# EasyEDA schematic SCH_WGE_Slimevr rev 2.2_2023-11-07.json
TITLE: ThingVR Pico tracker; REV: 2.1; Date: 2023-09-04; Sheet: 1/1; Drawn By: JuliLeThing; Company: ThingVR
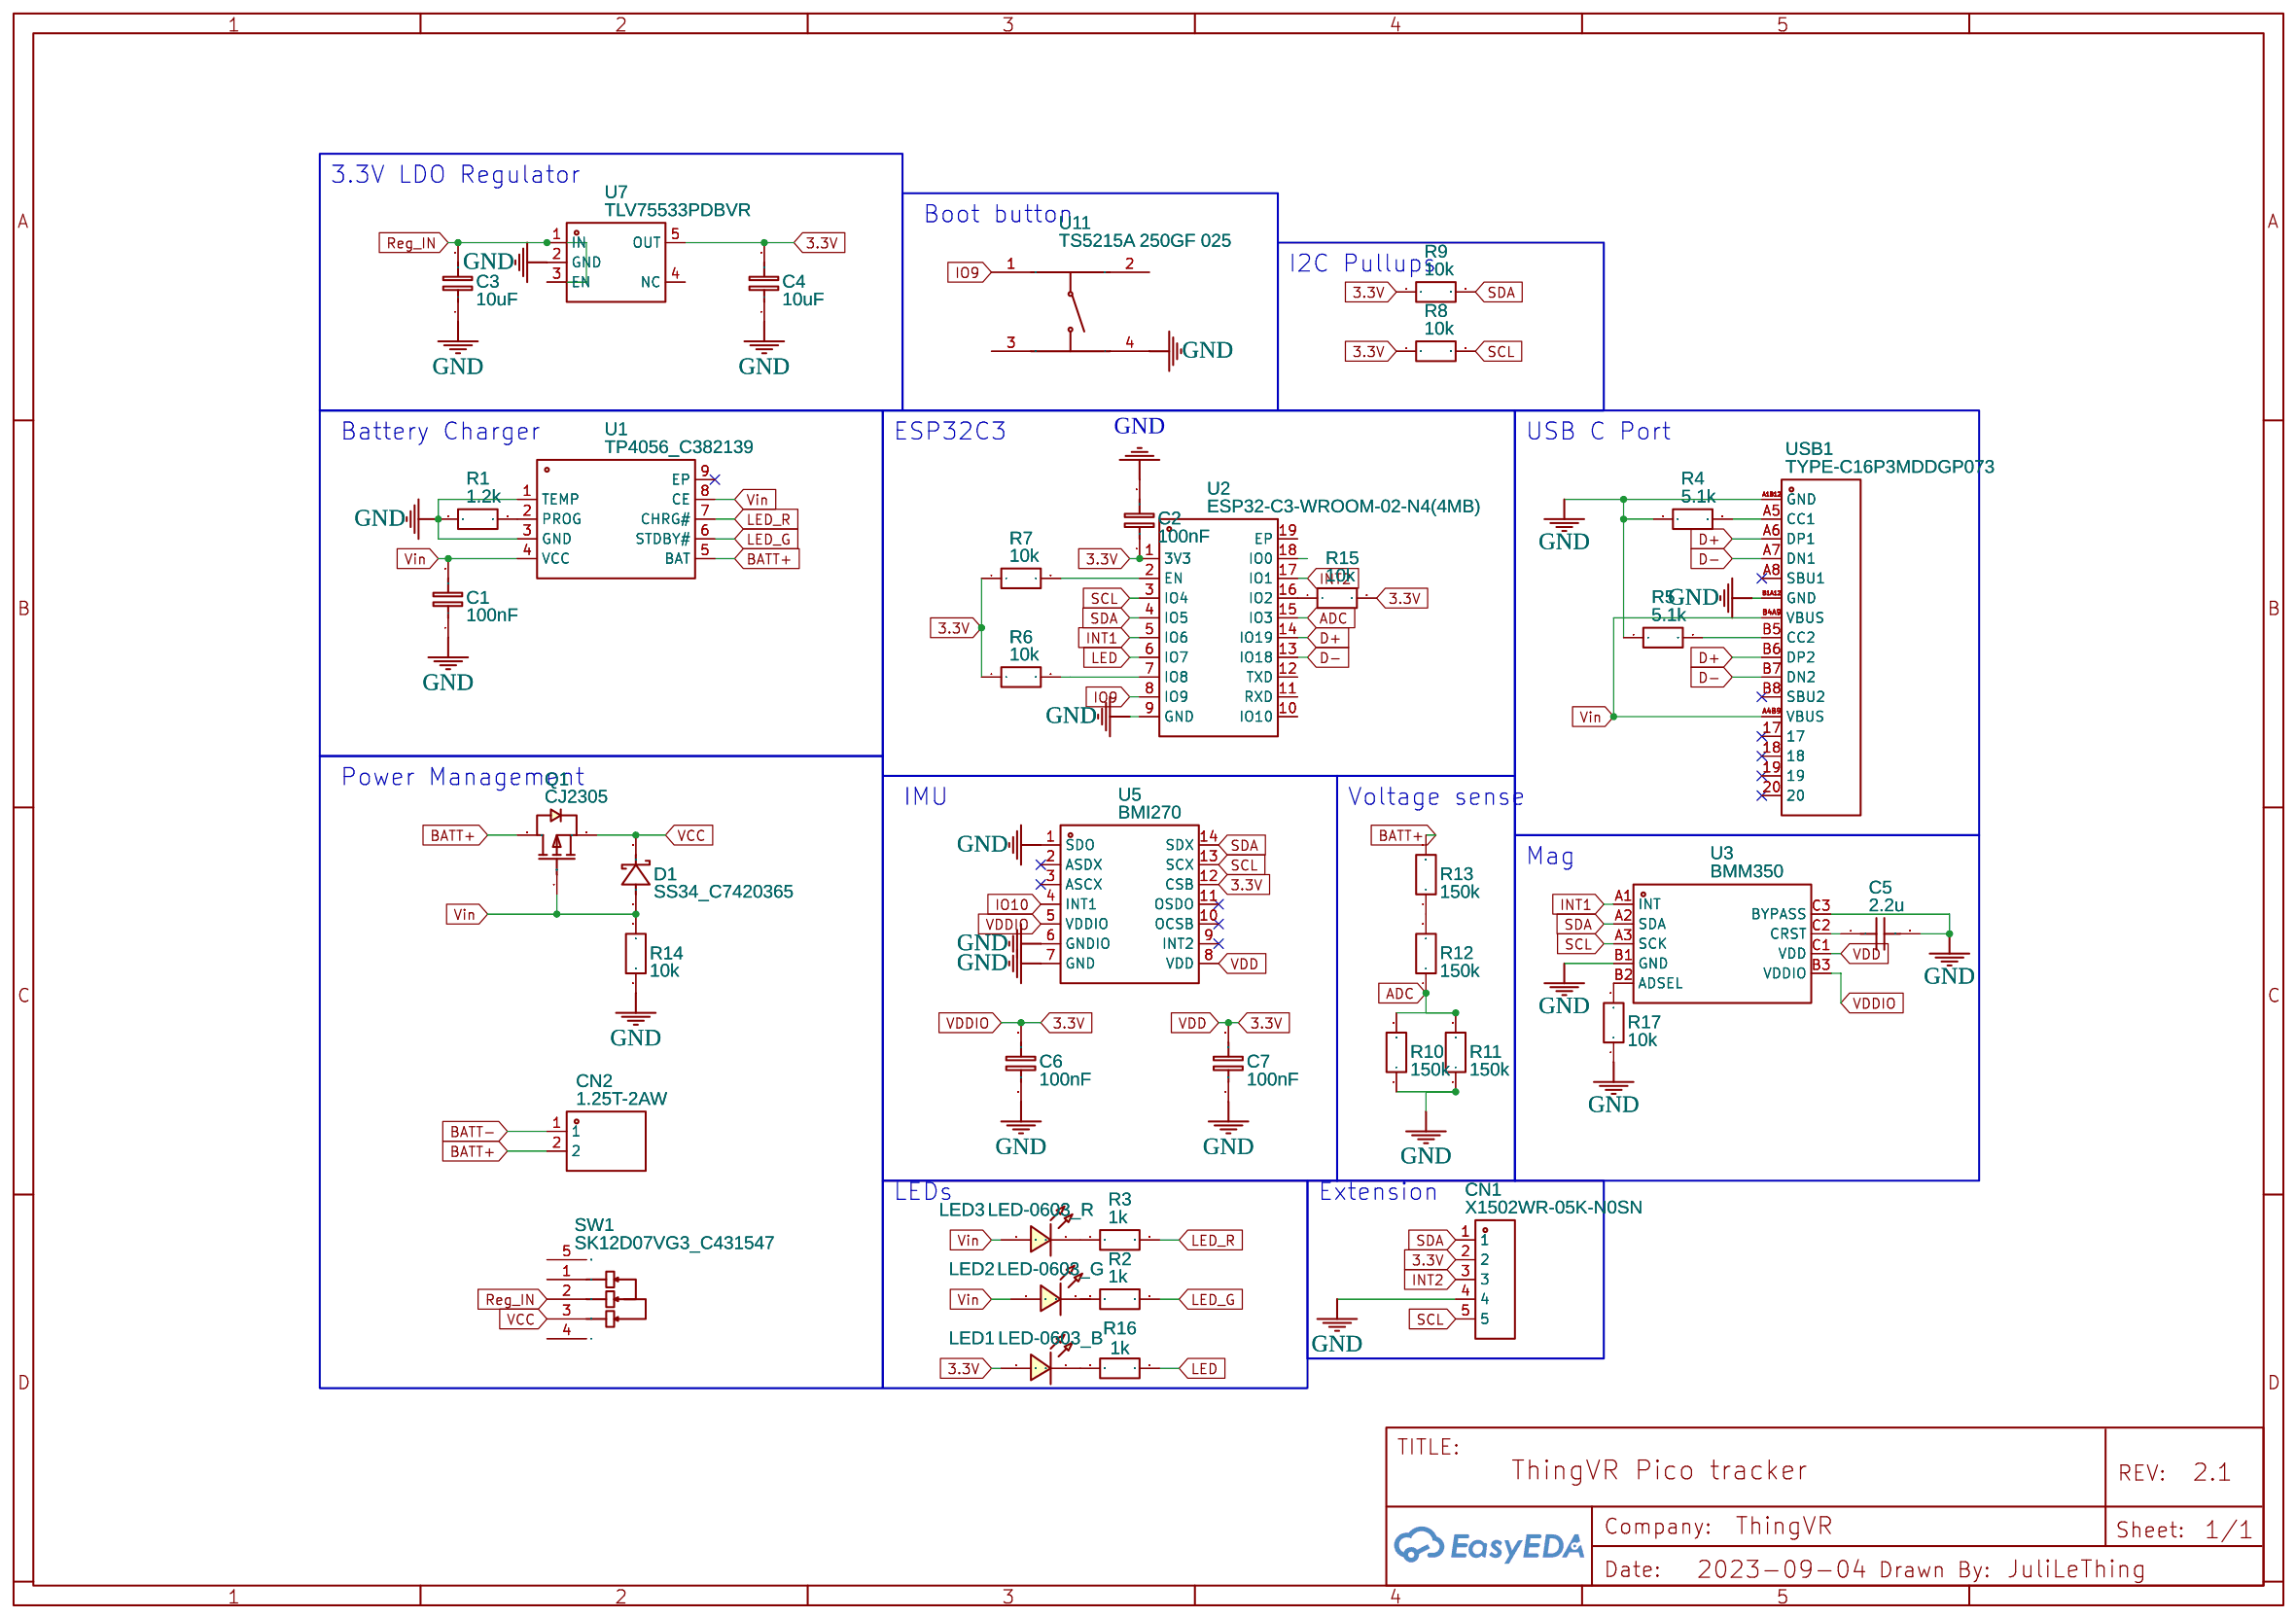
[diagram p0: schematic sheet]

## Parts
C1  100nF  [C0603]
C2  100nF  [C0603]
C3  10uF  [C0603]
C4  10uF  [C0603]
C5  2.2u  [C0603]
C6  100nF  [C0805]
C7  100nF  [C0805]
CN1  X1502WR-05K-N0SN  [CONN-TH_5P-P1.50_X1502WR-05K-N0SN]
CN2  1.25T-2AW  [CONN-TH_2P-P1.25_1.25T-2AW]
D1  SS34_C7420365  [SMA_L4.3-W2.6-LS5.0-FD]
LED1  LED-0603_B  [LED0603_BLUE]
LED2  LED-0603_G  [LED0603_GREEN]
LED3  LED-0603_R  [LED0603_RED]
Q1  CJ2305  [SOT-23-3_L2.9-W1.3-P1.90-LS2.4-BR]
R1  1.2k  [R0603]
R2  1k  [R0603]
R3  1k  [R0603]
R4  5.1k  [R0603]
R5  5.1k  [R0603]
R6  10k  [R0603]
R7  10k  [R0603]
R8  10k  [R0603]
R9  10k  [R0603]
R10  150k  [R0603]
R11  150k  [R0603]
R12  150k  [R0603]
R13  150k  [R0603]
R14  10k  [R0603]
R15  10k  [R0603]
R16  1k  [R0603]
R17  10k  [R0603]
SW1  SK12D07VG3_C431547  [SW-TH_SK12D07VG3]
U1  TP4056_C382139  [ESOP-8_L4.9-W3.9-P1.27-LS6.0-BL-EP]
U2  ESP32-C3-WROOM-02-N4(4MB)  [BULETM-SMD_ESPRESSIF_ESP32-C3-WROOM-02-N4-4MB]
U3  BMM350  [WLCSP-9_L1.3-W1.3-R3-C3-P0.40-TL]
U5  BMI270  [LGA-14_L3.0-W2.5-P0.50-BR]
U7  TLV75533PDBVR  [SOT-23-5_L3.0-W1.7-P0.95-LS2.8-BR]
U11  TS5215A 250GF 025  [SW-SMD_4P-L5.2-W5.2-P3.70-LS6.4]
USB1  TYPE-C16P3MDDGP073  [USB-SMD_TYPE-C16PIN-1]

## Library data of the parts
C1 = C_1206_EU: Supplier Part: C83060; Supplier: LCSC; Contributor: LCEDA_Lib; Manufacturer Part: 0603F104Z500CT; Manufacturer: Walsin(华新科)
C2 C6 C7 = C_0805_EU: Supplier Part: C519930; Supplier: LCSC; Contributor: LCEDA_Lib; Manufacturer Part: CC0805ZRY5V8BB104; Manufacturer: YAGEO(国巨)
C3 C4 = C_0805_EU: Supplier Part: C519978; Supplier: LCSC; Contributor: LCEDA_Lib; Manufacturer Part: CC0805KKX5R9BB105; Manufacturer: YAGEO(国巨)
C5 = C_0603_US: Contributor: LCEDA_Lib
CN1 = X1502WR-05K-N0SN: Contributor: LCSC; Supplier: LCSC; Supplier Part: C561537; Manufacturer: XKB Connectivity(中国星坤); JLCPCB Part Class: Extended Part; link: https://lcsc.com/eda_search?q=C561537&%26type=1&ref=editor
CN2 = 1.25T-2AW: Contributor: LCSC; Supplier: LCSC; Manufacturer: BOOMELE; Supplier Part: C145979; JLCPCB Part Class: Extended Part; link: https://lcsc.com/eda_search?q=C145979&%26type=1&ref=editor
D1 = SS34_C7420365: Supplier: LCSC; Supplier Part: C7420365; Manufacturer: 宏迦橙; Manufacturer Part: SS34; Contributor: lcsc; link: https://lcsc.com/eda_search?q=C7420365&%26type=1&ref=editor
LED1 = LED-0603_B: Manufacturer: EVERLIGHT(台湾亿光); Manufacturer Part: 19-217/BHC-ZL1M2RY/3T; Supplier Part: C72041; Supplier: LCSC; Contributor: LCEDA_01
LED2 = LED-0805_G: Manufacturer: 国星光电; Manufacturer Part: NCD0805G1; Supplier Part: C84260; Contributor: LCEDA_Lib
LED3 = LED-0805_R: Manufacturer: EVERLIGHT(台湾亿光); Manufacturer Part: 17-21SURC/S530-A3/TR8; Supplier Part: C72037; Contributor: LCEDA_Lib
Q1 = CJ2305: Supplier: LCSC; Manufacturer: CJ(江苏长电/长晶); Supplier Part: C8549; JLCPCB Part Class: Extended Part; link: https://lcsc.com/eda_search?q=C8549&%26type=1&ref=editor
R1 = R_1206_EU: Supplier Part: C269531; Supplier: LCSC; Contributor: LCEDA_Lib; Manufacturer Part: RMC08051.2K1%N; Manufacturer: Tyohm(幸亚电阻)
R2 R3 = R_0805_EU: Supplier Part: C176197; Supplier: LCSC; Contributor: LCEDA_Lib; Manufacturer Part: QR0805F1K00P05Z; Manufacturer: EVER OHMS(天二科技)
R4 R5 = R_0805_EU: Supplier Part: C269736; Supplier: LCSC; Contributor: LCEDA_Lib; Manufacturer Part: RMC08055.1K5%N; Manufacturer: Tyohm(幸亚电阻)
R6-R9 R14 R15 = R_0805_EU: Supplier Part: C138260; Supplier: LCSC; Contributor: LCEDA_Lib; Manufacturer Part: AC0805JR-0710KL; Manufacturer: YAGEO(国巨)
R10-R13 = R_0805_EU: Supplier Part: C137448; Supplier: LCSC; Contributor: LCEDA_Lib; Manufacturer Part: RC0805JR-07300KL; Manufacturer: YAGEO(国巨)
R16 = R_0603_EU: Supplier Part: C3017736; Supplier: LCSC; Contributor: LCEDA_Lib; Manufacturer Part: SCR0603J1K; Manufacturer: VO(翔胜)
R17 = R_0805_EU: Contributor: LCEDA_Lib
SW1 = SK12D07VG3_C431547: Contributor: LCSC; Supplier: LCSC; Supplier Part: C431547; Manufacturer: SHOU HAN; Manufacturer Part: SK12D07VG3; JLCPCB Part Class: Extended Part; link: https://lcsc.com/eda_search?q=C431547&%26type=1&ref=editor
U1 = TP4056_C382139: Contributor: LCSC; Supplier: LCSC; Supplier Part: C382139; Manufacturer: TPOWER(天源); Manufacturer Part: TP4056; JLCPCB Part Class: Extended Part; link: https://lcsc.com/eda_search?q=C382139&%26type=1&ref=editor
U2 = ESP32-C3-WROOM-02-N4(4MB): Contributor: LCSC; Supplier: LCSC; Supplier Part: C2934560; Manufacturer: ESPRESSIF(乐鑫); Manufacturer Part: ESP32-C3-WROOM-02-N4; JLCPCB Part Class: Extended Part; link: https://lcsc.com/eda_search?q=C2934560&%26type=1&ref=editor
U3 = BMM350: Supplier: LCSC; Supplier Part: C7496950; Manufacturer: Bosch(博世); JLCPCB Part Class: Extended Part
U5 = BMI270: Contributor: LCSC; Supplier: LCSC; Supplier Part: C2836813; Manufacturer: Bosch(博世); JLCPCB Part Class: Extended Part; link: https://lcsc.com/eda_search?q=C2836813&%26type=1&ref=editor
U7 = TLV75533PDBVR: Contributor: LCSC; Supplier: LCSC; Supplier Part: C404027; Manufacturer: TI(德州仪器); JLCPCB Part Class: Extended Part; link: https://lcsc.com/eda_search?q=C404027&%26type=1&ref=editor
U11 = TS5215A 250GF 025: Contributor: lcsc; Supplier: LCSC; Supplier Part: C5140332; Manufacturer: SHOU HAN(首韩); Manufacturer Part: TS5215A 250gf 025; link: https://lcsc.com/eda_search?q=C5140332&%26type=1&ref=editor
USB1 = TYPE-C16P3MDDGP073: Contributor: LCSC; Supplier: LCSC; Supplier Part: C2965608; Manufacturer: SHOU HAN(首韩); JLCPCB Part Class: Extended Part; link: https://lcsc.com/eda_search?q=C2965608&%26type=1&ref=editor

## Nets
3.3V: C2.1 C4.2 C6.2 C7.2 CN1.2 LED1.1 R6.1 R7.1 R8.1 R9.1 R15.2 U2.1(3V3) U3.B3(VDDIO) U3.C1(VDD) U5.5(VDDIO) U5.8(VDD) U5.12(CSB) U7.5(OUT)
GND: C1.1 C2.2 C3.1 C4.1 C5.2 C6.1 C7.1 CN1.4 R1.1 R4.1 R5.1 R10.1 R11.1 R14.1 R17.1 U1.1(TEMP) U1.3(GND) U2.9(GND) U3.B1(GND) U3.C3(BYPASS) U5.1(SDO) U5.6(GNDIO) U5.7(GND) U7.2(GND) U11.4 USB1.A1B12(GND) USB1.B1A12(GND)
VCC: D1.2(K) Q1.2(S) SW1.3
Vin: C1.2 D1.1(A) LED2.1 LED3.1 Q1.1(G) R14.2 U1.4(VCC) U1.8(CE) USB1.A4B9(VBUS) USB1.B4A9(VBUS)
ADC: R10.2 R11.2 R12.1 U2.15(IO3)
BATT+: CN2.2 Q1.3(D) R13.2 U1.5(BAT)
BATT-: CN2.1
D+: U2.14(IO19) USB1.A6(DP1) USB1.B6(DP2)
D-: U2.13(IO18) USB1.A7(DN1) USB1.B7(DN2)
INT1: U2.5(IO6) U3.A1(INT)
INT2: CN1.3 U2.17(IO1)
IO9: U2.8(IO9) U11.1
IO10: U5.4(INT1)
LED: R16.1 U2.6(IO7)
LED_G: R2.1 U1.6(STDBY#)
LED_R: R3.2 U1.7(CHRG#)
Reg_IN: C3.2 SW1.2 U7.1(IN) U7.3(EN)
SCL: CN1.5 R8.2 U2.3(IO4) U3.A3(SCK) U5.13(SCX)
SDA: CN1.1 R9.2 U2.4(IO5) U3.A2(SDA) U5.14(SDX)
Net-(C5-1): C5.1 U3.C2(CRST)
Net-(LED1-2): LED1.2 R16.2
Net-(LED2-2): LED2.2 R2.2
Net-(LED3-2): LED3.2 R3.1
Net-(R1-2): R1.2 U1.2(PROG)
Net-(R4-2): R4.2 USB1.A5(CC1)
Net-(R5-2): R5.2 USB1.B5(CC2)
Net-(R6-2): R6.2 U2.7(IO8)
Net-(R7-2): R7.2 U2.2(EN)
Net-(R12-2): R12.2 R13.1
Net-(R15-1): R15.1 U2.16(IO2)
Net-(R17-2): R17.2 U3.B2(ADSEL)

Not connected (* = marked no-connect by the designer): SW1 1 4 5; U1 9(EP)*; U2 10(IO10) 11(RXD) 12(TXD) 18(IO0) 19(EP); U5 2(ASDX)* 3(ASCX)* 9(INT2)* 10(OCSB)* 11(OSDO)*; U7 4(NC); U11 2 3; USB1 17* 18* 19* 20* A8(SBU1)* B8(SBU2)*

## Notes on the sheet
- 3.3V LDO Regulator
- Boot button
- I2C Pullups
- Battery Charger
- ESP32C3
- USB C Port
- Power Management
- IMU
- Voltage sense
- Mag
- LEDs
- Extension
